# Altium schematic sheet 18650M.SchDoc
size A4; SheetNumber: 1; SheetTotal: 1
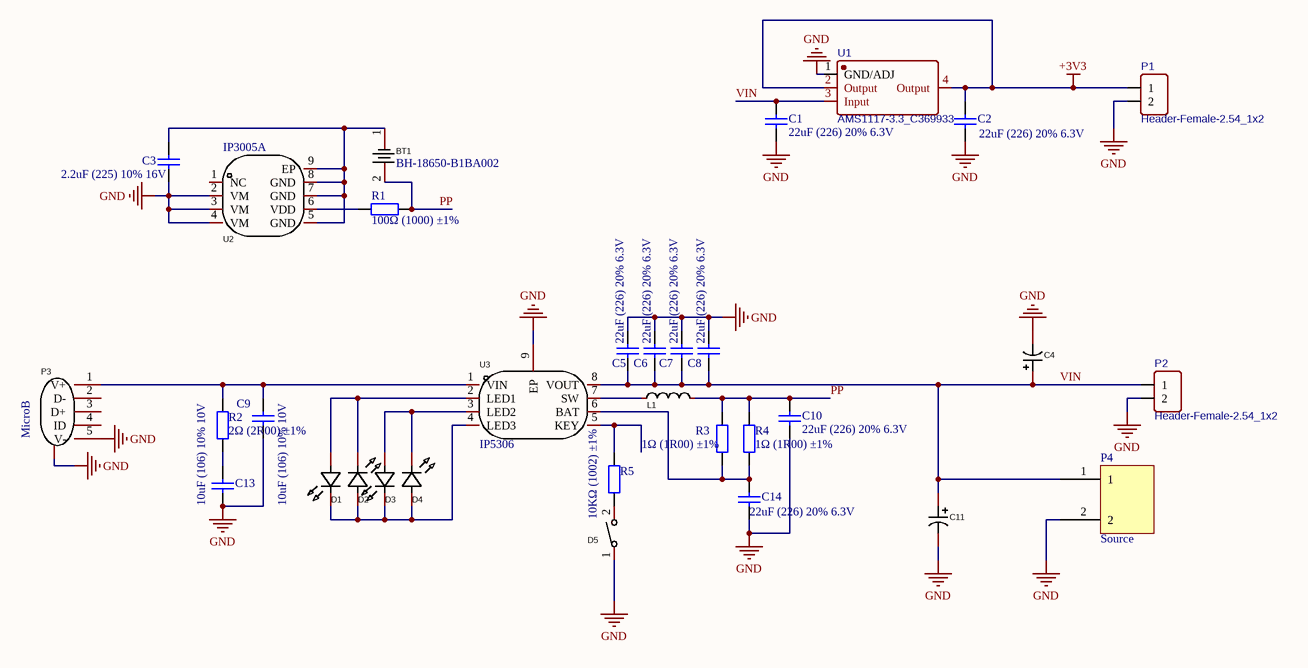
[diagram p0: 18650M.SchDoc]

## Parts
BT1  BH-18650-B1BA002  [BATTERY-SMD_18650-1S-L77.1-W20.7-1]
C1  22uF (226) 20% 6.3V  [0603_C]
C2  22uF (226) 20% 6.3V  [0603_C]
C3  2.2uF (225) 10% 16V  [0603_C]
C4  ULR107M1CE08TUX0CR  [CAP-TH_BD6.3-P2.50-D0.6-FD]  (value not drawn)
C5  22uF (226) 20% 6.3V  [0603_C]
C6  22uF (226) 20% 6.3V  [0603_C]
C7  22uF (226) 20% 6.3V  [0603_C]
C8  22uF (226) 20% 6.3V  [0603_C]
C9  10uF (106) 10% 10V  [0603_C]
C10  22uF (226) 20% 6.3V  [0603_C]
C11  ULR107M1CE08TUX0CR  [CAP-TH_BD6.3-P2.50-D0.6-FD]  (value not drawn)
C13  10uF (106) 10% 10V  [0603_C]
C14  22uF (226) 20% 6.3V  [0603_C]
D1  RF-BGB170TS-CB-E0  [LED0805-RD_BLUE]  (value not drawn)
D2  RF-BGB170TS-CB-E0  [LED0805-RD_BLUE]  (value not drawn)
D3  RF-BGB170TS-CB-E0  [LED0805-RD_BLUE]  (value not drawn)
D4  RF-BGB170TS-CB-E0  [LED0805-RD_BLUE]  (value not drawn)
D5  TS342A2P-WZ  [SW-SMD_L4.0-W2.9-LS5.0]  (value not drawn)
L1  NBMC0630N-1R0M  [IND-SMD_L7.4-W6.6]  (value not drawn)
P1  Header-Female-2.54_1x2  [HDR-TH_2P-P2.54-V-F]
P2  Header-Female-2.54_1x2  [HDR-TH_2P-P2.54-V-F]
P3  MicroB  [MICRO-USB-SMD_5P-P0.65-H-F_C10418]
P4  Source  [XT30-M]
R1  100Ω (1000) ±1%  [0603_R]
R2  2Ω (2R00) ±1%  [0603_R]
R3  1Ω (1R00) ±1%  [0603_R]
R4  1Ω (1R00) ±1%  [0603_R]
R5  10KΩ (1002) ±1%  [0603_R]
U1  AMS1117-3.3_C369933  [SOT-223-4_L6.5-W3.5-P2.30-LS7.0-BR]
U2  IP3005A  [ESOP-8_L4.9-W3.9-P1.27-LS6.0-BL-EP]
U3  IP5306  [ESOP-8_L4.9-W3.9-P1.27-LS6.0-BL-EP]

## Nets
+3V3: C2.2 P1.1 U1.2(Output) U1.4(Output)
GND: C1.1 C2.1 C3.1 C4.2 C5.2 C6.2 C7.2 C8.2 C9.1 C10.1 C11.2 C13.1 C14.1 D5.1 P1.2 P2.2 P3.0(MTN) P3.5(V-) P4.2 U1.1(GND/ADJ) U2.2(VM) U2.3(VM) U2.4(VM) U3.9(EP)
PP: BT1.2 C10.2 L1.2 R1.2 R3.2 R4.2
VIN: C1.2 C4.1 C5.1 C6.1 C7.1 C8.1 C11.1 P2.1 P4.1 U1.3(Input) U3.8(VOUT)
NetBT1_1: BT1.1 C3.2 U2.5(GND) U2.7(GND) U2.8(GND) U2.9(EP)
NetC9_2: C9.2 P3.1(V+) R2.2 U3.1(VIN)
NetC13_2: C13.2 R2.1
NetC14_2: C14.2 R3.1 R4.1 U3.6(BAT)
NetD1_1: D1.1(K) D2.2(A) D3.1(K) D4.2(A) U3.4(LED3)
NetD1_2: D1.2(A) D2.1(K) U3.2(LED1)
NetD3_2: D3.2(A) D4.1(K) U3.3(LED2)
NetD5_2: D5.2 R5.1
NetL1_1: L1.1 U3.7(SW)
NetR1_1: R1.1 U2.6(VDD)
NetR5_2: R5.2 U3.5(KEY)

Not connected (* = marked no-connect by the designer): P3 2(D-) 3(D+) 4(ID); U2 1(NC)

## Library data of the parts
BT1 = BH-18650-B1BA002: Manufacturer: MYOUNG(美阳); Add into BOM: yes; Name: BH-18650-B1BA002; Symbol: BH-18650-B1BA002; Device: BH-18650-B1BA002; LCSC Part Name: 电池盒BH-18650; Supplier Part: C2988620; Manufacturer Part: BH-18650-B1BA002; Supplier Footprint: SMD; JLCPCB Part Class: Extended Part; Datasheet: https://atta.szlcsc.com/upload/public/pdf/source/20220402/870DB99AB50CA0DF8D51CF7C86A51FAB.pdf; Supplier: LCSC; Convert to PCB: yes
C1 C2 C5-C8 C10 C14 = 0603 22uF (226) 20% 6.3V: 贴片电容; ComponentLink1Description: 供应商链接; ComponentLink1URL: http://www.szlcsc.com/product/details_60514.html; Package: 0603; Supplier: LC; SuppliersPartNumber: C59461
C3 = 0603 2.2uF (225) 10% 16V: 贴片电容; ComponentLink1Description: 供应商链接; ComponentLink1URL: http://www.szlcsc.com/product/details_24366.html; Package: 0603; Supplier: LC; SuppliersPartNumber: C23630
C4 C11 = 100uF/16V: Manufacturer: MAN YUE(万裕科技); Name: 100uF; Add into BOM: yes; Type: 聚合物; Value: 100uF; Tolerance: ±20%; Rated Voltage: 16V; φD: 6.3mm; L: 8mm; Lifetime @ Temp: 2000hrs@105℃; Symbol: ULR107M1CE08TUX0CR; Device: ULR107M1CE08TUX0CR; LCSC Part Name: 100uF ±20% 16V; Supplier Part: C2923568; Manufacturer Part: ULR107M1CE08TUX0CR; Supplier Footprint: 径向引线,6.3x8mm; JLCPCB Part Class: Extended Part; Datasheet: https://atta.szlcsc.com/upload/public/pdf/source/20211118/585B9CEDE9E08D4A86043C401C7B1F80.pdf; Supplier: LCSC; Convert to PCB: yes; Lead Spacing: 2.5mm; Ripple Current: -; Equivalent Series Resistance(ESR): -; Operating Temperature: -55℃~+105℃
C9 C13 = 0603 10uF (106) 10% 10V: 贴片电容; ComponentLink1Description: 供应商链接; ComponentLink1URL: http://www.szlcsc.com/product/details_20411.html; Package: 0603; Supplier: LC; SuppliersPartNumber: C19702
D1-D4 = RF-BGB170TS-CB-E0: Manufacturer: Refond(瑞丰); Add into BOM: yes; Emitted Color: 蓝灯; Forward Current: 20mA; Power Dissipation: 70mW; Viewing Angle: 140°; Mounting Sytle: 正贴; Symbol: RF-BGB170TS-CB-E0; Device: RF-BGB170TS-CB-E0; LCSC Part Name: 蓝灯 正贴; Supplier Part: C2908306; Manufacturer Part: RF-BGB170TS-CB-E0; Supplier Footprint: 0805; JLCPCB Part Class: Extended Part; Datasheet: https://atta.szlcsc.com/upload/public/pdf/source/20211101/C871A18E9B6E101B84BDF0C661245F86.pdf; Supplier: LCSC; Convert to PCB: yes; Diode Configuration: -; Lens Color: -; Dominant Wavelength: -; Peak Wavelength: -; Color Temperature: -; Luminous Flux (@25℃): -; Forward Voltage (VF): -; Luminous Intensity: -; Operating Temperature: -40℃~+85℃
D5 = TS342A2P-WZ: Manufacturer: SHOU HAN(首韩); Add into BOM: yes; Symbol: TS342A2P-WZ; Device: TS342A2P-WZ; LCSC Part Name: 轻触开关 3*4*2 两脚小龟不带柱 250gf 黑色塑胶按钮; Supplier Part: C557591; Manufacturer Part: TS342A2P-WZ; Supplier Footprint: SMD; JLCPCB Part Class: Extended Part; Datasheet: https://atta.szlcsc.com/upload/public/pdf/source/20200519/C557591_B3A5A21584733303F06306F18577DA8B.pdf; Supplier: LCSC; Convert to PCB: yes
L1 = NBMC0630N-1R0M: Manufacturer: MINGSTAR(登壹); Name: 1uH; Add into BOM: yes; Value: 1uH; Tolerance: ±20%; Symbol: NBMC0630N-1R0M; Device: NBMC0630N-1R0M; LCSC Part Name: 1uH ±20%; Supplier Part: C2875673; Manufacturer Part: NBMC0630N-1R0M; Supplier Footprint: SMD,7x6.6x3mm; JLCPCB Part Class: Extended Part; Datasheet: https://atta.szlcsc.com/upload/public/pdf/source/20211027/23FFED1A6381AC91BC7E25CCB8D3B08F.pdf; Supplier: LCSC; Convert to PCB: yes
P1 P2 = Header-Female-2.54_1x2: BOM_Manufacturer: BOOMELE; BOM_Manufacturer Part: 2.54-1*2PFemale; BOM_Supplier: LCSC; BOM_Supplier Part: C49661; BOM_JLCPCB Part Class: Extended Part; spicePre: P; spiceSymbolName: Header-Female-2.54_1x2
P3 = MicroB: Manufacturer: 精拓金; Symbol: micro USBFemale; Device: 920-E52A2021S10100; Add into BOM: yes; Connector Type: Micro-B; Gender: 母座; Number of Contacts: 5; Number of Ports: 1; Current Rating - Power (Max): 1A; LCSC Part Name: Micro-B 母座; Supplier Part: C10418; Manufacturer Part: 920-E52A2021S10100; Supplier Footprint: SMD; JLCPCB Part Class: Extended Part; Datasheet: https://atta.szlcsc.com/upload/public/pdf/source/20210305/C10418_4890444E73C7CF5EB311058F76E5ECA4.pdf; Supplier: LCSC; Convert to PCB: yes; Standard: USB 2.0
P4 = XT30: System: Connector
R1 = 0603 100Ω (1000) 1%: 贴片电阻; ComponentLink1Description: 供应商链接; ComponentLink1URL: http://www.szlcsc.com/product/details_23502.html; Package: 0603; Supplier: LC; SuppliersPartNumber: C22775
R2 = 0603 2Ω (2R00) 1%: 贴片电阻; ComponentLink1Description: 供应商链接; ComponentLink1URL: http://www.szlcsc.com/product/details_23704.html; Package: 0603; Supplier: LC; SuppliersPartNumber: C22977
R3 R4 = 0603 1Ω (1R00) 1%: 贴片电阻; ComponentLink1Description: 供应商链接; ComponentLink1URL: http://www.szlcsc.com/product/details_23663.html; Package: 0603; Supplier: LC; SuppliersPartNumber: C22936
R5 = 0603 10KΩ (1002) 1%: 贴片电阻; ComponentLink1Description: 供应商链接; ComponentLink1URL: http://www.szlcsc.com/product/details_26547.html; Package: 0603; Supplier: LC; SuppliersPartNumber: C25804
U1 = AMS1117-3.3_C369933: BOM_Manufacturer: KEXIN; Contributor: LCSC; BOM_Supplier: LCSC; BOM_Supplier Part: C369933; BOM_Manufacturer Part: AMS1117-3.3; BOM_JLCPCB Part Class: Extended Part; spicePre: U; spiceSymbolName: AMS1117-3.3_C369933
U2 = IP3005A: Manufacturer: INJOINIC(英集芯); Add into BOM: yes; Name: IP3005A; Symbol: IP3005A; Device: IP3005A; LCSC Part Name: IP3005A; Supplier Part: C181685; Manufacturer Part: IP3005A; Supplier Footprint: ESOP-8; JLCPCB Part Class: Extended Part; Datasheet: https://atta.szlcsc.com/upload/public/pdf/source/20181019/C181685_8FCD62B90ABBC24A3EFF28CA6DF89AAB.pdf; Supplier: LCSC; Convert to PCB: yes; Battery Chemistry: -; Number of Cells: -; Charge Current - Max: -; Battery Pack Voltage: -; Voltage - Supply (Max): -; Interface: -
U3 = IP5306: Manufacturer: INJOINIC(英集芯); Add into BOM: yes; Name: IP5306; Symbol: IP5306; Device: IP5306; LCSC Part Name: IP5306; Supplier Part: C181692; Manufacturer Part: IP5306; Supplier Footprint: ESOP-8; JLCPCB Part Class: Extended Part; Datasheet: https://atta.szlcsc.com/upload/public/pdf/source/20180920/C181692_842C9BF636DF123BB66E91FC1AD6F13F.pdf; Supplier: LCSC; Convert to PCB: yes; Battery Chemistry: -; Number of Cells: -; Charge Current - Max: -; Battery Pack Voltage: -; Voltage - Supply (Max): -; Interface: -